# Altium schematic sheet GPIO SUB.SchDoc
size A4; SheetNumber: 9; SheetTotal: 12
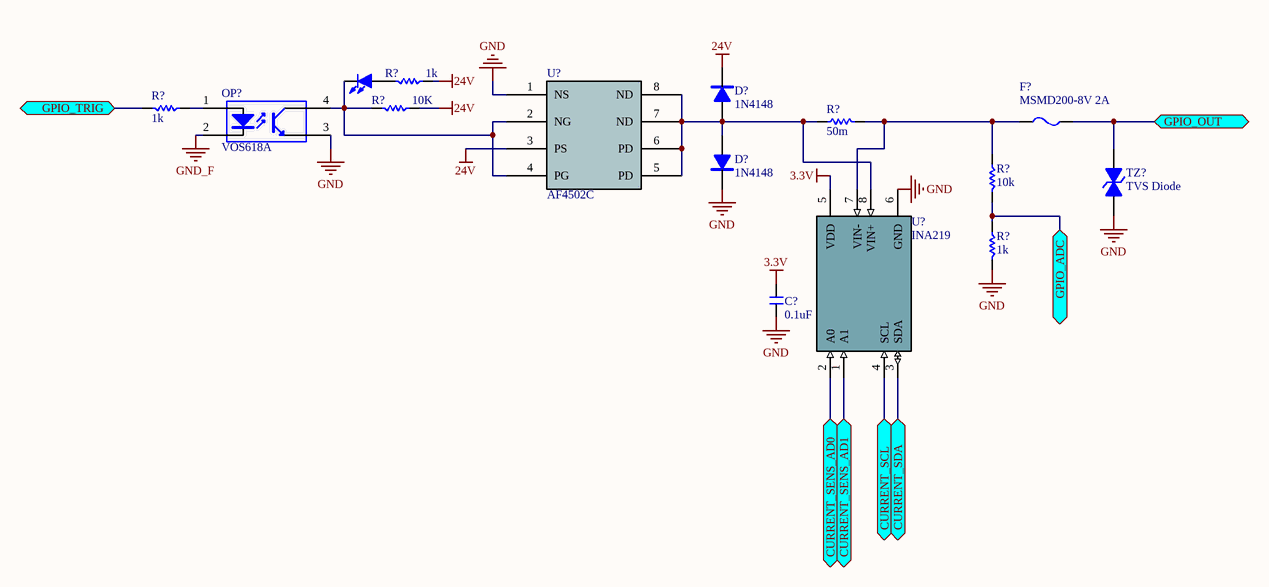
[diagram p0: GPIO SUB.SchDoc]

## Parts
(Parts that share a designator on the sheet are numbered #1, #2 ... from top to bottom, then left to right.)
C?  0.1uF  [C 0805]
D?#1  1N4148  [SOD-323]
D?#2  1N4148  [SOD-323]
F?  MSMD200-8V 2A  [FU 0805]
LED?  LED-SMD  [LED 0805B]  (value not drawn)
OP?  VOS618A  [VOS618A-SSOP4]
R?#1  1k  [R 0805]
R?#2  1k  [R 0805]
R?#3  10K  [R 0805]
R?#4  50m  [R 1812]
R?#5  10k  [R 0805]
R?#6  1k  [R 0805]
TZ?  TVS Diode  [SMB]
U?#1  AF4502C  [SOP8_L]
U?#2  INA219  [SOT23-8]

## Ports
CURRENT_SCL (bidir), CURRENT_SDA (bidir), CURRENT_SENS_AD0 (bidir), CURRENT_SENS_AD1 (bidir), GPIO_ADC (bidir), GPIO_OUT (bidir), GPIO_TRIG (bidir)

## Nets
3.3V: C?.2 U?#2.5(VDD)
24V: D?#1.2(K) R?#1.1 R?#3.1 U?#1.3(PS)
GND: C?.1 D?#2.2(K) OP?.3(E) R?#6.2 TZ?.1(A) U?#1.1(NS) U?#2.6(GND)
GND_F: OP?.2(K)
CURRENT_SCL: U?#2.4(SCL) ; port CURRENT_SCL
CURRENT_SDA: U?#2.3(SDA) ; port CURRENT_SDA
CURRENT_SENS_AD0: U?#2.2(A0) ; port CURRENT_SENS_AD0
CURRENT_SENS_AD1: U?#2.1(A1) ; port CURRENT_SENS_AD1
GPIO_ADC: R?#5.2 R?#6.1 ; port GPIO_ADC
GPIO_OUT: F?.2 TZ?.2(K) ; port GPIO_OUT
GPIO_TRIG: R?#2.2 ; port GPIO_TRIG
NetD?#1_1: D?#1.1(A) D?#2.1(A) R?#4.1 U?#1.5(PD) U?#1.6(PD) U?#1.7(ND) U?#1.8(ND) U?#2.8(VIN+)
NetF?_1: F?.1 R?#4.2 R?#5.1 U?#2.7(VIN-)
NetLED?_1: LED?.1(A) R?#1.2
NetLED?_2: LED?.2(K) OP?.4(C) R?#3.2 U?#1.2(NG) U?#1.4(PG)
NetOP?_1: OP?.1(A) R?#2.1

## Library data of the parts
C? = C: Non-polar patch capacitor; BOM名称: 无极性贴片电容; 版权归属: 源创客; 学习资源: www.ooocke.com
D?#1 D?#2 = 1N4148: High speed switching diode; BOM名称: 高速开关二极管; 版权归属: 源创客; 学习资源: www.ooocke.com
F? = FU: Chip fuse; BOM名称: 贴片保险丝; 版权归属: 源创客; 学习资源: www.ooocke.com
LED? = LED-SMD: Patch LED; BOM名称: 贴片LED; 版权归属: 源创客; 学习资源: www.ooocke.com
R?#1-R?#6 = R: Chip resistor; 版权归属: 源创客; BOM名称: Chip resistor; 学习资源: www.ooocke.com
TZ? = SMBJ-CA: Surface Mount TRANSZORB® Transient Voltage Suppressors
U?#1 = AF4502C: PN-Mosfet